# EAGLE design ledboard (EAGLE 9.3.2)
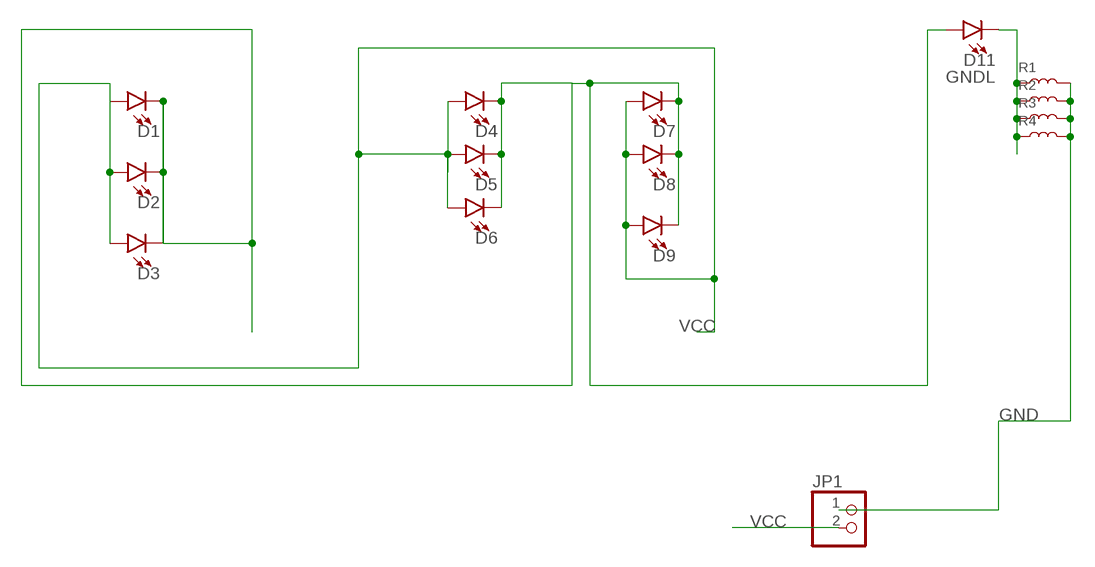
[diagram p0: schematic, sheet 1]

## Parts
D1  LED5MM  [LED_5MM]
D2  LED5MM  [LED_5MM]
D3  LED5MM  [LED_5MM]
D4  LED5MM  [LED_5MM]
D5  LED5MM  [LED_5MM]
D6  LED5MM  [LED_5MM]
D7  LED5MM  [LED_5MM]
D8  LED5MM  [LED_5MM]
D9  LED5MM  [LED_5MM]
D11  LED5MM  [LED_5MM]
JP1  PINHD-1X2  [1X02]
R1  INDUCTOR-AXL-REGULAR  [AXL-INDUCTOR]
R2  INDUCTOR-AXL-REGULAR  [AXL-INDUCTOR]
R3  INDUCTOR-AXL-REGULAR  [AXL-INDUCTOR]
R4  INDUCTOR-AXL-REGULAR  [AXL-INDUCTOR]

## Nets
GND: JP1.1 R1.2 R2.2 R3.2 R4.2
GNDL: D1.K(C) D2.K(C) D3.K(C) D4.K(C) D5.K(C) D6.K(C) D7.K(C) D8.K(C) D9.K(C) D11.A
N$1: D11.K(C) R1.1 R2.1 R3.1 R4.1
VCC: D1.A D2.A D3.A D4.A D5.A D6.A D7.A D8.A D9.A JP1.2

## Library data of the parts
D1-D9 D11 = SparkFun-LED:LED: LED (Generic) Standard schematic elements and footprints for 5mm, 3mm, 1206, and 0603 sized LEDs. Generic LEDs with no color specified.
JP1 = DC_LOAD_AU:PINHD-1X2: PIN HEADER
R1-R4 = FaBo-Inductor:INDUCTOR: RESISTOR

## Board
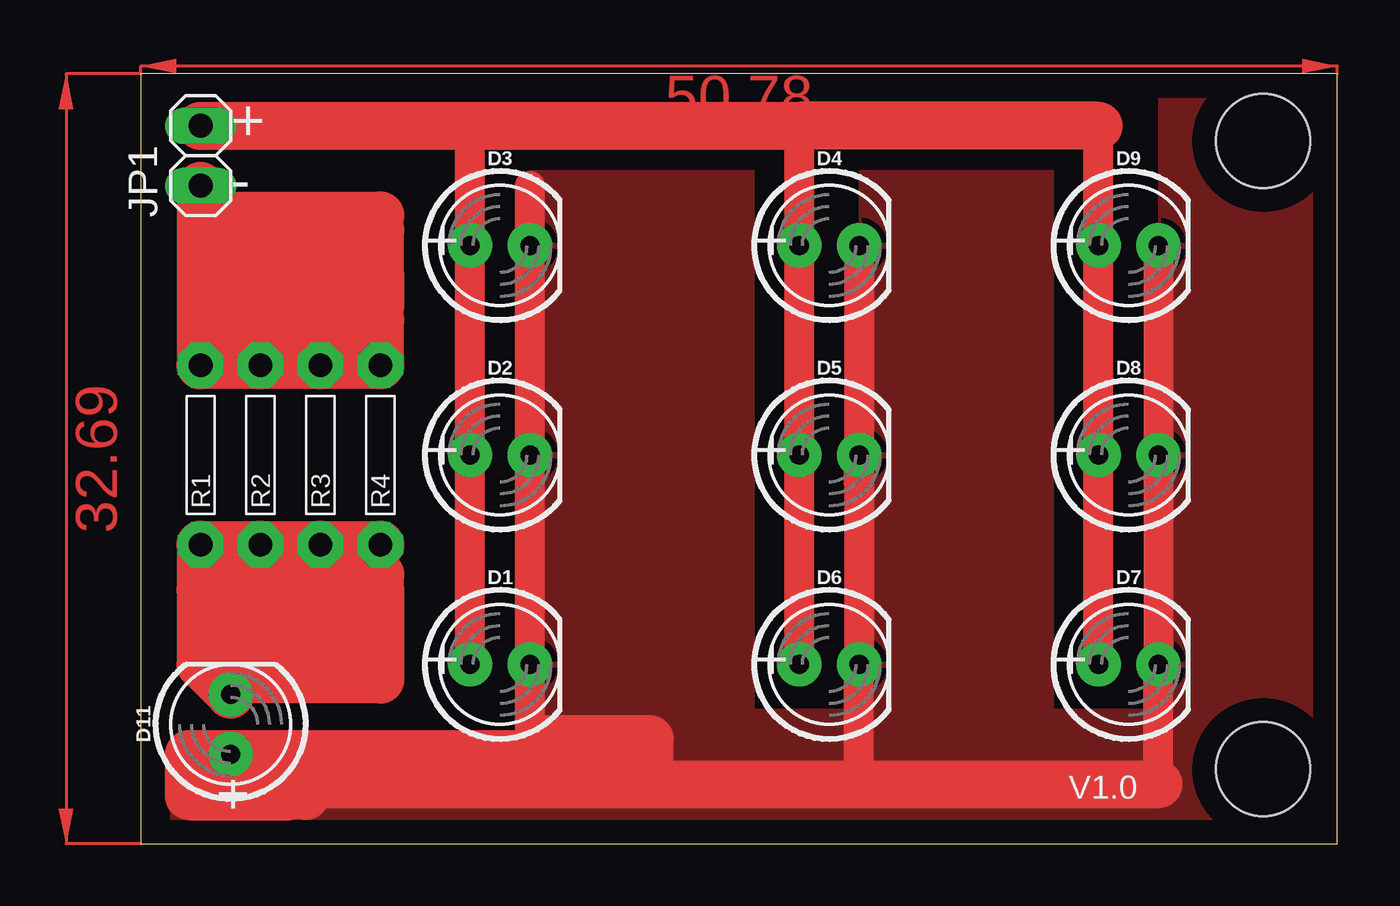
[diagram p1: board, top side]
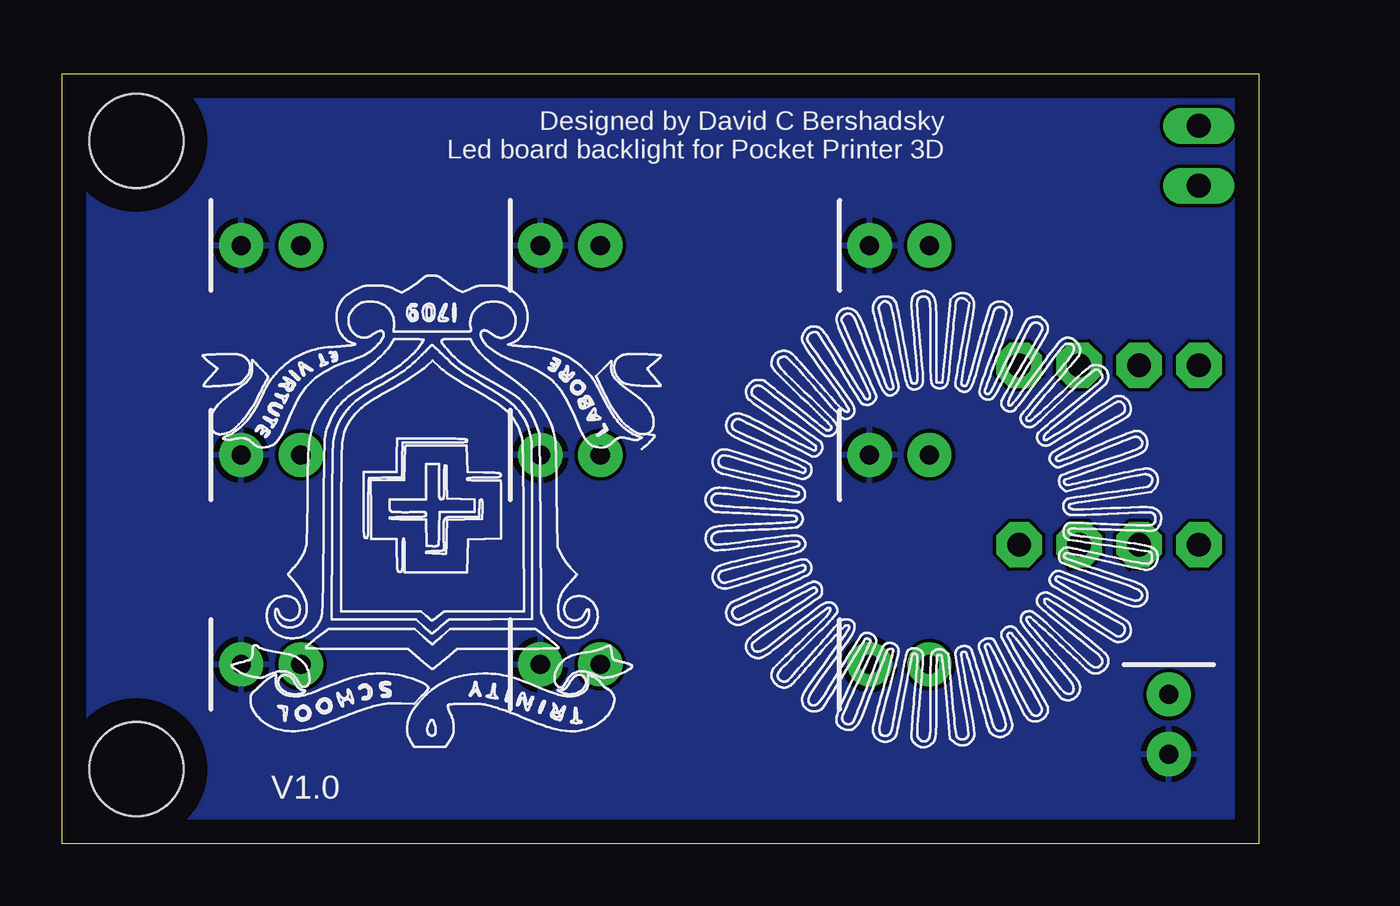
[diagram p2: board, bottom side, seen from below]

Size 50.78 x 32.69 mm. Coordinates in mm from the lower left corner, seen from the top.
Outline: 0,0 50.78,0 50.78,32.69 0,32.69 0,0
Copper layers (1*16): Top 0.035mm / dielectric 1.5mm / Bottom 0.035mm
Design rules "default": minimum track width 6mil, minimum drill 0.35mm, track to track 6mil, track to pad 6mil, pad to pad 6mil, via to via 6mil, smd to smd 6mil, copper to edge 40mil, drill to drill 6mil, minimum pad ring 10mil, minimum via ring 8mil, stop-mask expansion 4mil, vias tented up to drill 0mil, thermal gap 10mil
Holes 3.99 mm at 47.62,29.85 47.62,3.18

### Footprints (pad centres in the part's own frame; a part is rotated, then mirrored left to right if it is on the bottom)
LED_5MM = drill 0.813 pad 1.88: A -1.27,0; K 1.27,0
1X02 = drill 1.016 long: 1 -1.27,0; 2 1.27,0
AXL-INDUCTOR = drill 1 pad 1.93 octagon: 1 -3.81,0; 2 3.81,0

### Placement (x,y rotation side)
D1  15.24,7.62 0 top
D2  15.24,16.51 0 top
D3  15.24,25.4 0 top
D4  29.21,25.4 0 top
D5  29.21,16.51 0 top
D6  29.21,7.62 0 top
D7  41.91,7.62 0 top
D8  41.91,16.51 0 top
D9  41.91,25.4 0 top
D11  3.81,5.08 90 top
JP1  2.54,29.21 90 top
R1  2.54,16.51 90 top
R2  5.08,16.51 90 top
R3  7.62,16.51 90 top
R4  10.16,16.51 90 top

### Tracks (layer width: path | path; a pad name or v marks a point on that pad's centre or on a via)
GND
  Top 2.032: JP1.1 R1.2 R2.2 R3.2 R4.2 10.16,22.22 3.17,22.22 | 3.17,22.22 3.17,21.59 | 3.17,22.22 3.17,24.13 10.16,24.13 | 10.16,24.13 10.16,22.86 | 10.16,24.13 10.16,26.04 3.81,26.04 3.81,26.67 10.16,26.67
GNDL
  Top 1.27: 16.51,2.54 D1.K D2.K D3.K 16.51,27.94 | D4.K D5.K | 30.48,15.24 D5.K | D5.K D6.K 30.48,2.54 | D9.K D8.K D7.K 43.18,2.54
  Top 2.032: 6.99,2.54 6.35,2.54 6.35,2.03 2.03,2.03 2.03,3.81 D11.A 17.14,3.81 17.14,4.45 21.59,4.45 21.59,2.54 | 6.99,2.54 16.51,2.54 21.59,2.54 | 21.59,2.54 30.48,2.54 43.18,2.54 | 6.99,2.54 6.99,2.03
  pour Top: 15.87,3.81 25.4,3.81 50.16,3.81 50.16,4.45 50.16,31.75 43.18,31.75 43.18,5.71 38.73,5.71 38.73,28.57 31.11,28.57 30.48,28.57 30.48,5.71 27.3,5.71 26.03,5.71 26.03,27.94 26.03,28.57 16.51,28.57 16.51,5.08 15.87,5.08
  pour Bottom: 0,32.39 50.8,32.39 50.8,0 0,0
  pour Top: 50.16,3.81 50.16,0.63 1.27,0.63 1.27,4.45 50.16,4.45
N$1
  Top 2.032: R1.1 2.54,7.62 D11.K | R1.1 R2.1 R3.1 R4.1 | R1.1 2.54,10.79 10.16,10.79 | 10.16,10.79 10.16,11.43 | 10.16,10.79 10.16,8.25 3.17,8.25 3.17,9.52 10.16,9.52 10.16,6.98 4.44,6.98 4.44,7.62
VCC
  Top 1.27: D6.A D5.A D4.A 27.94,30.48 | D7.A D8.A D9.A 40.64,30.48 | D1.A D2.A D3.A 13.97,30.48
  Top 2.032: JP1.2 13.97,30.48 27.94,30.48 40.64,30.48
(copper drawn outside any net)
  shapes: Top area x2

### Text on the board
tNames: + | - | + | + | + | + | + | + | + | + | + | V1.0 | +
bNames: Designed by David C Bershadsky / Led board backlight for Pocket Printer 3D | V1.0